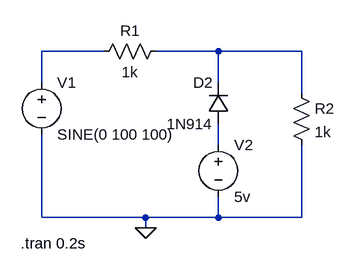
[diagram p0: schematic 7.Shunt Clipper(NP).asc]
7.Shunt Clipper(NP).asc, the LTspice schematic file:
Version 4
SHEET 1 880 680
WIRE 208 80 112 80
WIRE 384 80 288 80
WIRE 512 80 384 80
WIRE 112 128 112 80
WIRE 384 128 384 80
WIRE 512 144 512 80
WIRE 384 224 384 192
WIRE 112 336 112 208
WIRE 272 336 112 336
WIRE 384 336 384 304
WIRE 384 336 272 336
WIRE 512 336 512 224
WIRE 512 336 384 336
WIRE 272 352 272 336
FLAG 272 352 0
SYMBOL voltage 112 112 R0
WINDOW 123 0 0 Left 0
WINDOW 39 0 0 Left 0
SYMATTR InstName V1
SYMATTR Value SINE(0 100 100)
SYMBOL res 304 64 R90
WINDOW 0 0 56 VBottom 2
WINDOW 3 32 56 VTop 2
SYMATTR InstName R1
SYMATTR Value 1k
SYMBOL diode 400 192 R180
WINDOW 0 24 64 Left 2
WINDOW 3 24 0 Left 2
SYMATTR InstName D2
SYMATTR Value 1N914
SYMBOL voltage 384 208 R0
WINDOW 123 0 0 Left 0
WINDOW 39 0 0 Left 0
SYMATTR InstName V2
SYMATTR Value 5v
SYMBOL res 496 128 R0
SYMATTR InstName R2
SYMATTR Value 1k
TEXT 80 376 Left 2 !.tran 0.2s

The netlist it stands for:
* 7.Shunt Clipper(NP).asc
V1 N001 0 SINE(0 100 100)
R1 N002 N001 1k
D2 N003 N002 1N914
V2 N003 0 5v
R2 N002 0 1k
.model D D
.lib standard.dio
.tran 0.2s
.backanno
.end